# Altium project PCB_Project.PrjPcb
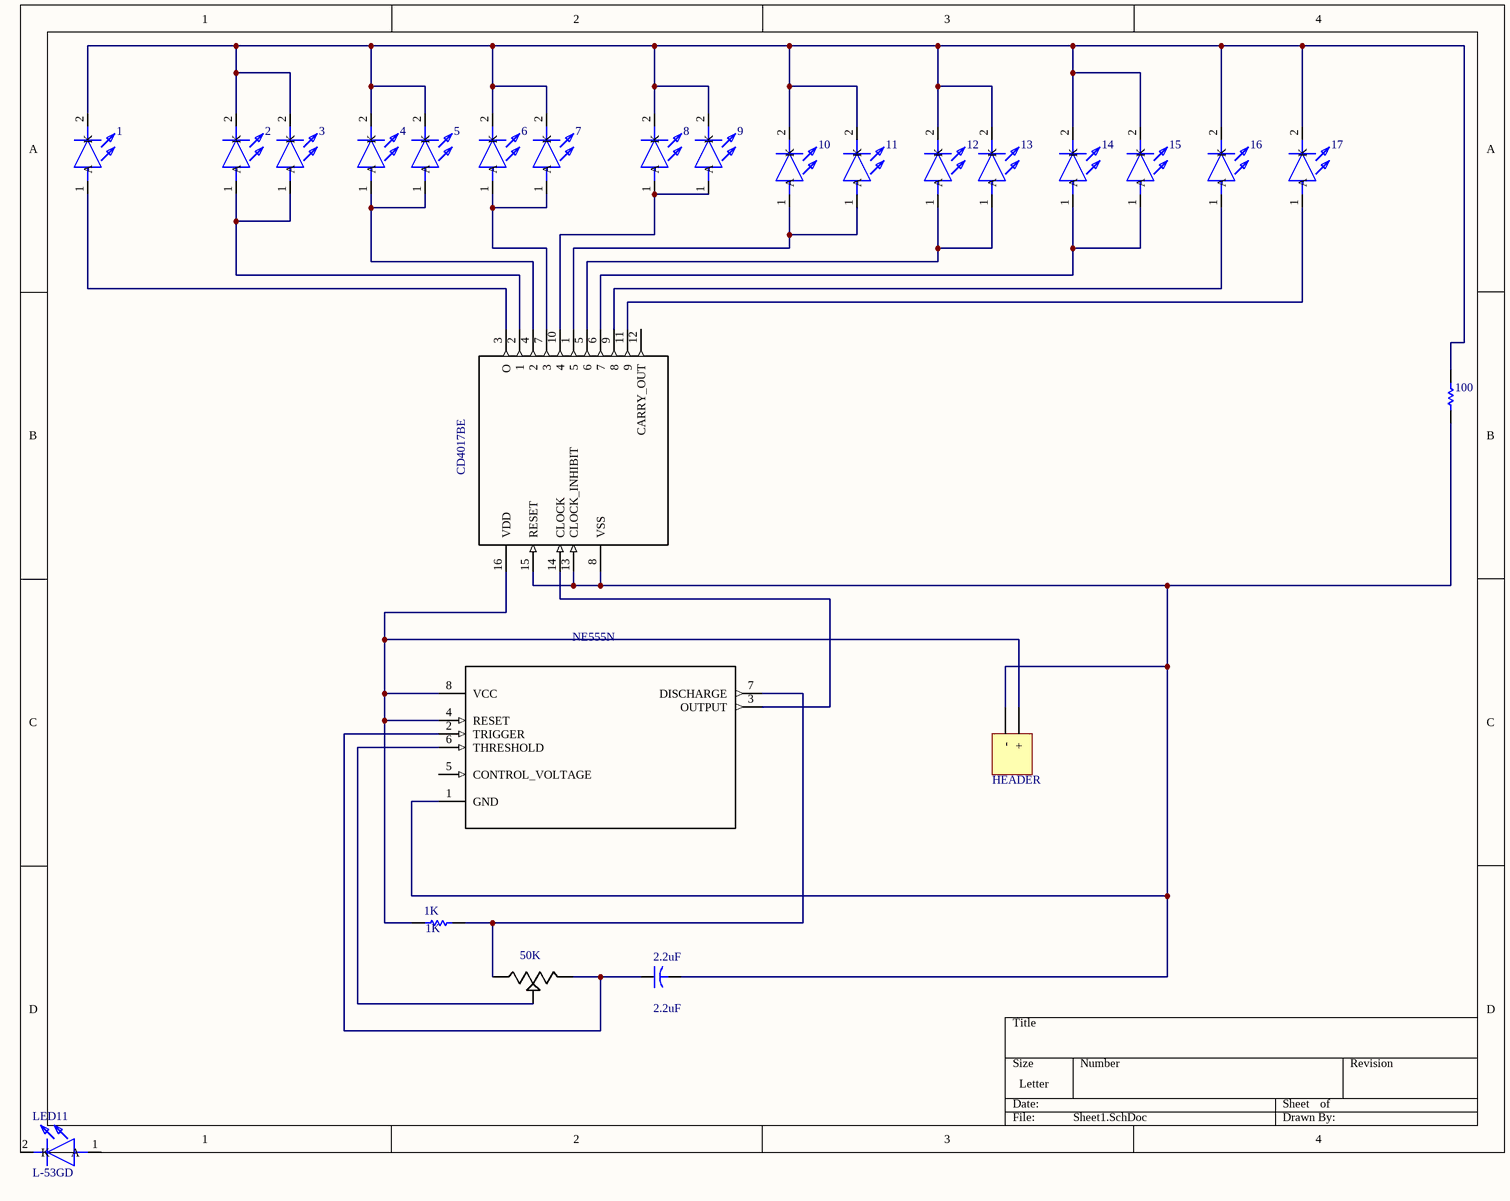
[diagram p0: Sheet1.SchDoc]
1 sheet, 25 parts. Net scope: global (net labels, ports and power ports of the same name join across sheets).
Board file: PCB1.PcbDoc

## Sheet Sheet1.SchDoc
size Letter

### Parts
1  1  [L-53GD]  (value not drawn)
1K  value 1K  [AXIAL-0.3]  (hidden comment: Res1)
2  1  [L-53GD]  (value not drawn)
2.2uF  value 2.2uF  [CAPR5-4X5]  (hidden comment: Cap2)
3  1  [L-53GD]  (value not drawn)
4  3  [L-53GD]  (value not drawn)
5  1  [L-53GD]  (value not drawn)
6  4  [L-53GD]  (value not drawn)
7  1  [L-53GD]  (value not drawn)
8  5  [L-53GD]  (value not drawn)
9  1  [L-53GD]  (value not drawn)
10  6  [L-53GD]  (value not drawn)
11  1  [L-53GD]  (value not drawn)
12  7  [L-53GD]  (value not drawn)
13  1  [L-53GD]  (value not drawn)
14  8  [L-53GD]  (value not drawn)
15  1  [L-53GD]  (value not drawn)
16  9  [L-53GD]  (value not drawn)
17  10  [L-53GD]  (value not drawn)
50K  100K  [*TRIM_EVN-D8AA03B14]  (value not drawn)
100  120  [AXIAL-0.3]  (value not drawn)
CD4017BE  CD4017BE  [*DIP254P762X508-16]  (value not drawn)
HEADER  Header 2  [HDR1X2]  (value not drawn)
LED11  L-53GD  [L-53GD]
NE555N  NE555N  [*DIP254P762X533-8]  (value not drawn)

### Nets
Net1_1: 1.1(A) CD4017BE.3(O)
Net1_2: 1.2(K) 2.2(K) 3.2(K) 4.2(K) 5.2(K) 6.2(K) 7.2(K) 8.2(K) 9.2(K) 10.2(K) 11.2(K) 12.2(K) 13.2(K) 14.2(K) 15.2(K) 16.2(K) 17.2(K) 100.1
Net1K_1: 1K.1 CD4017BE.16(VDD) HEADER.1(+) NE555N.4(RESET) NE555N.8(VCC)
Net1K_2: 1K.2 50K.1 NE555N.7(DISCHARGE)
Net2.2uF_1: 2.2uF.1 50K.3 NE555N.2(TRIGGER)
Net2.2uF_2: 2.2uF.2 100.2 CD4017BE.8(VSS) CD4017BE.13(CLOCK_INHIBIT) CD4017BE.15(RESET) HEADER.2(-) NE555N.1(GND)
Net2_1: 2.1(A) 3.1(A) CD4017BE.2(1)
Net4_1: 4.1(A) 5.1(A) CD4017BE.4(2)
Net6_1: 6.1(A) 7.1(A) CD4017BE.7(3)
Net8_1: 8.1(A) 9.1(A) CD4017BE.10(4)
Net10_1: 10.1(A) 11.1(A) CD4017BE.1(5)
Net12_1: 12.1(A) 13.1(A) CD4017BE.5(6)
Net14_1: 14.1(A) 15.1(A) CD4017BE.6(7)
Net16_1: 16.1(A) CD4017BE.9(8)
Net17_1: 17.1(A) CD4017BE.11(9)
Net50K_2: 50K.2 NE555N.6(THRESHOLD)
NetCD4017BE_14: CD4017BE.14(CLOCK) NE555N.3(OUTPUT)

Not connected (* = marked no-connect by the designer): CD4017BE 12(CARRY_OUT); LED11 1(A) 2(K); NE555N 5(CONTROL_VOLTAGE)

### Library data of the parts
1-17 LED11 = L-53GD: LED; Manufacturer_Name: Kingbright; Allied_Number: 70424261; Datasheet Link: http://docs-emea.rs-online.com/webdocs/151e/0900766b8151e408.pdf; Manufacturer_Part_Number: L-53GD; Mouser Part Number: N/A; Mouser Price/Stock: https://www.mouser.com/Search/Refine.aspx?Keyword=N%2FA; RS Part Number: 2286004A; RS Price/Stock: http://uk.rs-online.com/web/p/products/2286004A; Allied Price/Stock: http://www.alliedelec.com/kingbright-l-53gd/70424261/
1K = Res1: Resistor; Published: 8-Jun-2000; LatestRevisionDate: 17-Jul-2002; LatestRevisionNote: Re-released for DXP Platform.; PackageReference: AXIAL-0.3; Publisher: Altium Limited; PackageDescription: Axial Device, Thru-Hole; 2 Leads; 0.3 in Pin Spacing
2.2uF = Cap2: Capacitor; Published: 23-Sep-2002; PackageReference: CAPR5-4X5; Publisher: Altium Limited; PackageDescription: Capacitor; 2 Leads
50K = EVN-D8AA03B14: Trimmer; Carbon; Rest 10 Kilohms; PCB; 1 Turn; Pwr-Rtg 0.1 W; Linear; Top Adj; 6 mm SQ; MF: Panasonic Electronic; Availability: Unavailable; Price: None; SnapEDA_Link: https://www.snapeda.com/parts/EVN-D8AA03B14/Panasonic%20Electronic%20Components/view-part/?ref=snap; MP: EVN-D8AA03B14; Package: PQFP-44 Panasonic; Value: *
100 = Res1: Resistor; Value: 1K; Published: 8-Jun-2000; LatestRevisionDate: 17-Jul-2002; LatestRevisionNote: Re-released for DXP Platform.; PackageReference: AXIAL-0.3; Publisher: Altium Limited; PackageDescription: Axial Device, Thru-Hole; 2 Leads; 0.3 in Pin Spacing
CD4017BE = CD4017BE: IC Mos 4017/CD4017BE HARRIS; MF: Texas; SnapEDA_Link: https://www.snapeda.com/parts/CD4017BE/Texas%20Instruments/view-part/?ref=snap; Availability: Unavailable; Price: None; MP: CD4017BE; Package: DIP-16 Intersil; Value: *
HEADER = Header 2: Header, 2-Pin; LatestRevisionDate: 17-Jul-2002; LatestRevisionNote: Re-released for DXP Platform.; Publisher: Altium Limited
NE555N = NE555N: MF: ON Semiconductor; Price: None; SnapEDA_Link: https://www.snapeda.com/parts/NE555N/ON%20Semiconductor/view-part/?ref=snap; Availability: Unavailable; MP: NE555N; Package: DIP-8 Texas Instruments; Value: *